# EAGLE design RaspiPowerHat (EAGLE 6.5.0)

## Sheet 1 of 3
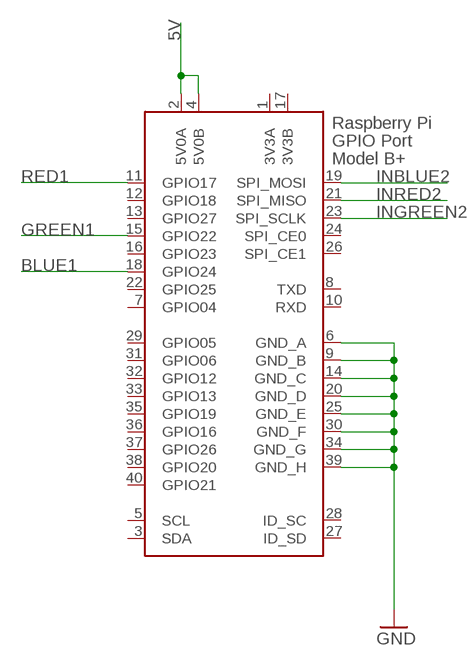
[diagram p0: schematic, sheet 1]

### Parts
X1  RASPI_GPIO_B+#_PIN  [RASPI_GPIO_B+_PIN]

### Nets
5V: X1.2(5V0A) X1.4(5V0B) ; also sheet 2
BLUE1: X1.18(GPIO24) ; also sheet 3
GND: X1.6(GND_A) X1.9(GND_B) X1.14(GND_C) X1.20(GND_D) X1.25(GND_E) X1.30(GND_F) X1.34(GND_G) X1.39(GND_H) ; also sheet 2,3
GREEN1: X1.15(GPIO22) ; also sheet 3
INBLUE2: X1.19(SPI_MOSI) ; also sheet 3
INGREEN2: X1.23(SPI_SCLK) ; also sheet 3
INRED2: X1.21(SPI_MISO) ; also sheet 3
RED1: X1.11(GPIO17) ; also sheet 3
Unconnected: X1.3(SDA) X1.5(SCL) X1.7(GPIO04) X1.8(TXD) X1.10(RXD) X1.12(GPIO18) X1.13(GPIO27) X1.16(GPIO23) X1.22(GPIO25) X1.24(SPI_CE0) X1.26(SPI_CE1) X1.27(ID_SD) X1.28(ID_SC) X1.29(GPIO05) X1.31(GPIO06) X1.32(GPIO12) X1.33(GPIO13) X1.35(GPIO19) X1.36(GPIO16) X1.37(GPIO26) X1.38(GPIO20) X1.40(GPIO21)

## Sheet 2 of 3: Power
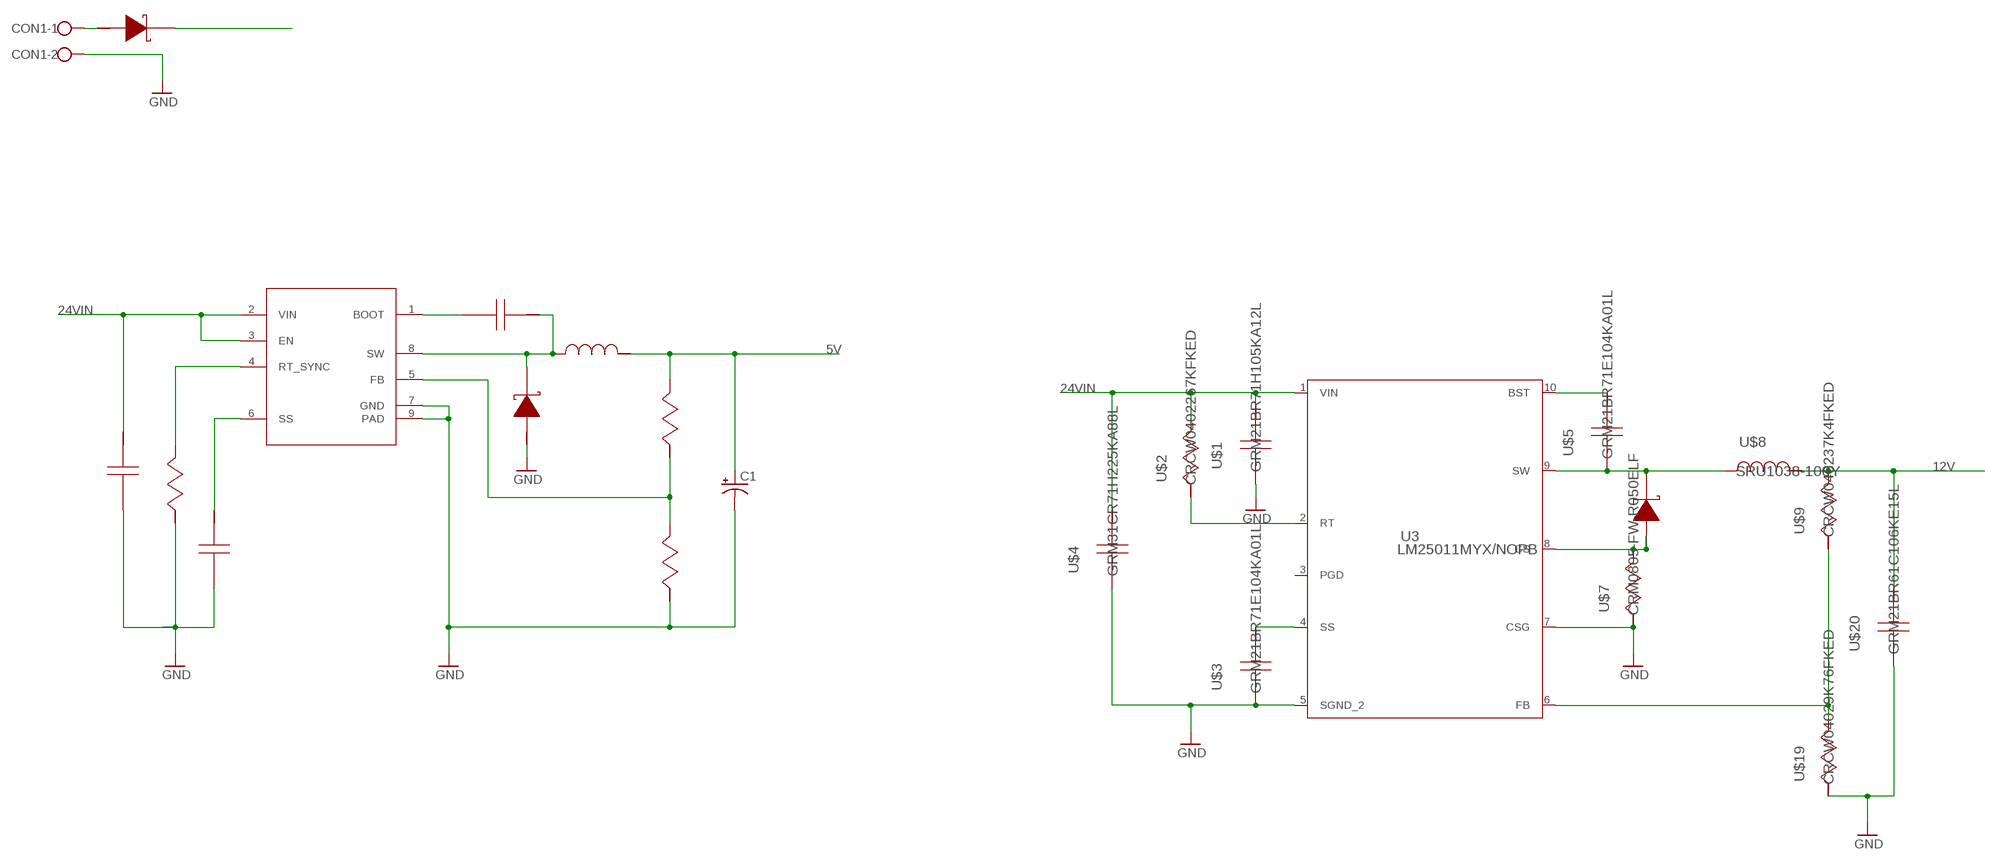
[diagram p1: schematic, sheet 2]

### Parts
C1  CPOL-USC  [PANASONIC_C]
CON1  W237-102  [W237-102]
U2  Value  LMR14050SDDAR  [DDA0008E_N]
U3  LM25011MYX/NOPB  [MUC10A]
U$1  GRM21BR71H105KA12L  [0805]
U$2  CRCW0402267KFKED  [0402]
U$3  GRM21BR71E104KA01L  [0805]
U$4  GRM31CR71H225KA88L  [1206_190]
U$5  GRM21BR71E104KA01L  [0805]
U$6  B360A-13-F  [SMA]
U$7  CRM0805-FW-R050ELF  [0805]
U$8  SRU1038-100Y  [SRU1038]
U$9  CRCW040237K4FKED  [0402]
U$10  C0805C104K5RACTU  [0805]
U$11  VLP8040T-6R8M  [VLP8040]
U$12  B360A-13-F  [SMA]
U$13  RC0603FR-0768KL  [0603]
U$14  RC0603FR-0712KL  [0603]
U$15  B360A-13-F  [SMA]
U$16  GRM155R71C822KA01D  [0402]
U$17  CRCW040224K3FKED  [0402]
U$18  GRM31CR71H225KA88L  [1206_190]
U$19  CRCW04029K76FKED  [0402]
U$20  GRM21BR61C106KE15L  [0805]

### Nets
5V: C1.+ U$11.2 U$13.1 ; also sheet 1
12V: U$8.2 U$9.1 U$20.1 ; also sheet 3
24VIN: U2.2(VIN) U2.3(EN) U3.1(VIN) U$1.1 U$2.1 U$4.1 U$15.1(K) U$18.1
GND: C1.- CON1.2 U2.7(GND) U2.9(PAD) U3.5(SGND_2) U3.7(CSG) U$1.2 U$3.2 U$4.2 U$7.2 U$12.2(A) U$14.2 U$16.2 U$17.2 U$18.2 U$19.2 U$20.2 ; also sheet 1,3
N$1: U3.2(RT) U$2.2
N$2: CON1.1 U$15.2(A)
N$3: U3.4(SS) U$3.1
N$4: U3.10(BST) U$5.1
N$5: U3.9(SW) U$5.2 U$6.1(K) U$8.1
N$6: U2.1(BOOT) U$10.2
N$7: U2.8(SW) U$10.1 U$11.1 U$12.1(K)
N$8: U2.5(FB) U$13.2 U$14.1
N$9: U2.6(SS) U$16.1
N$10: U2.4(RT_SYNC) U$17.1
N$11: U3.8(CS) U$6.2(A) U$7.1
N$14: U3.6(FB) U$9.2 U$19.1
Unconnected: U3.3(PGD)

## Sheet 3 of 3: LEDs
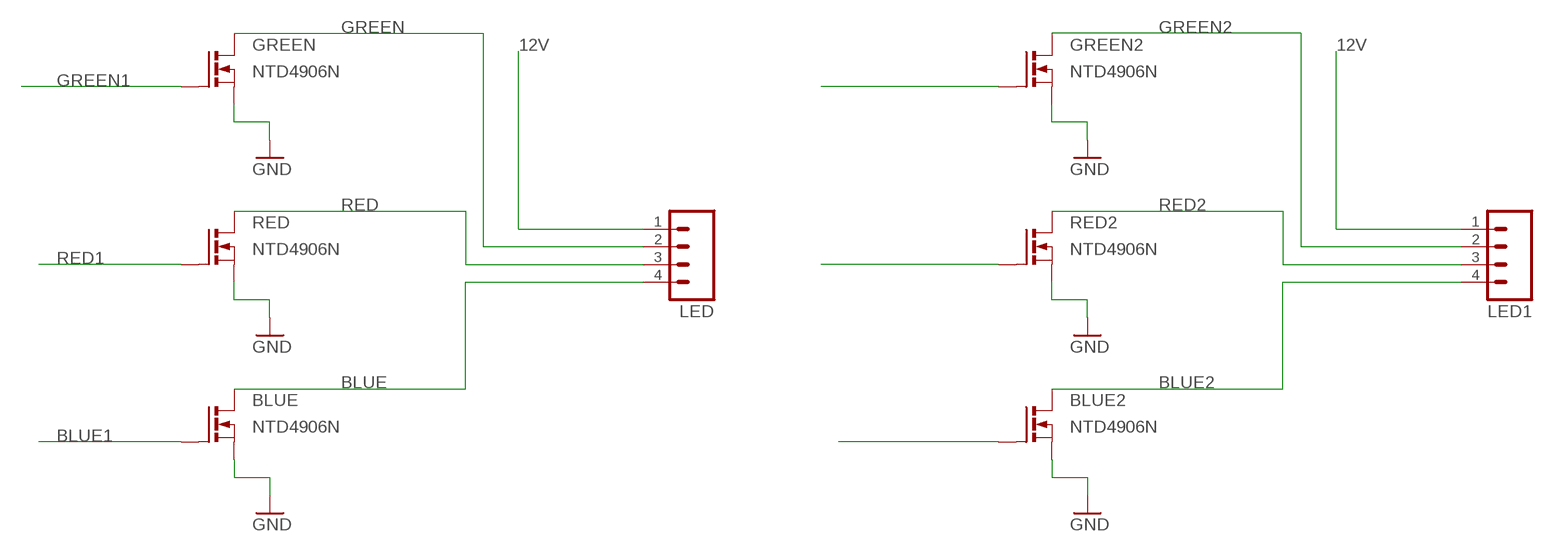
[diagram p2: schematic, sheet 3]

### Parts
BLUE  NTD4906N  4906N  [D-PAK_TO252AA]
BLUE2  NTD4906N  4906N  [D-PAK_TO252AA]
GREEN  NTD4906N  4906N  [D-PAK_TO252AA]
GREEN2  NTD4906N  4906N  [D-PAK_TO252AA]
LED  M04JST-PTH-VERT  [JST-4-PTH-VERT]
LED1  M04JST-PTH-VERT  [JST-4-PTH-VERT]
RED  NTD4906N  4906N  [D-PAK_TO252AA]
RED2  NTD4906N  4906N  [D-PAK_TO252AA]

### Nets
12V: LED1.1 LED.1 ; also sheet 2
BLUE: BLUE.4(D) LED.4
BLUE1: BLUE.1(G) ; also sheet 1
BLUE2: BLUE2.4(D) LED1.4
GND: BLUE2.3(SG1) BLUE.3(SG1) GREEN2.3(SG1) GREEN.3(SG1) RED2.3(SG1) RED.3(SG1) ; also sheet 1,2
GREEN: GREEN.4(D) LED.2
GREEN1: GREEN.1(G) ; also sheet 1
GREEN2: GREEN2.4(D) LED1.2
INBLUE2: BLUE2.1(G) ; also sheet 1
INGREEN2: GREEN2.1(G) ; also sheet 1
INRED2: RED2.1(G) ; also sheet 1
RED: LED.3 RED.4(D)
RED1: RED.1(G) ; also sheet 1
RED2: LED1.3 RED2.4(D)

## Power pins joined to a net without a drawn wire
3V3A: X1.1(3V3A)
3V3B: X1.17(3V3B)

## Library data of the parts
BLUE BLUE2 GREEN GREEN2 RED RED2 = transistor-power:4906N
C1 = rcl:CPOL-US: POLARIZED CAPACITOR, American symbol
CON1 = con-wago-500:W237-102: WAGO SCREW CLAMP; MPN: 237-102; OC_FARNELL: unknown; OC_NEWARK: 70K9898
LED LED1 = SparkFun-Connectors:M04: Header 4 Standard 4-pin 0.1" header. Use with straight break away headers (SKU : PRT-00116), right angle break away headers (PRT-00553), swiss pins (PRT-00743), machine pins (PRT-00117), and female headers (PRT-00115). Molex polarized connector foot print use with SKU : PRT-08231 with associated crimp pins and housings. 1MM SMD Version SKU: PRT-10208
U2 = TI-LMR14050SSDA:LMR14050SDDAR; ALTERNATEPARTNUMBER: LMR14050SDDA; APPLICATION_BUILDNUMBER: *; COMPTYPE: IC; MANUFACTURER: Texas Instruments; MANUFACTURER_NAME: Texas Instruments; MANUFACTURER_PART_NUMBER: LMR14050SDDAR; MOUNTTYPE: SMT; PACKAGEREFERENCE: DDA0008E; PARTNUMBER: LMR14050SDDAR; PIN_COUNT: 9; REFDES: RefDes; ROHS: Y; TYPE: TYPE
U3 = TILM25011:LM25011MYX/NOPB; DATASHEETURL: http://www.ti.com/product/lm25011; FREQUENCY: 2000000.0; IMAX: 2.0; MANUFACTURER_NAME: Texas Instruments; MANUFACTURER_PART_NUMBER: LM25011MYX/NOPB; MKTG_PACKAGE: NA; NSID: LM25011MY/NOPB; PACKAGE: NA; VENDOR: Texas Instruments
U$1 = TILM25011:GRM21BR71H105KA12L; CAP: 1.0E-6; ESR: 0.0; IRMS: 0.0; MANUFACTURER_NAME: MuRata; MANUFACTURER_PART_NUMBER: GRM21BR71H105KA12L; VDC: 50.0; VENDOR: MuRata
U$2 = TILM25011:CRCW0402267KFKED; MANUFACTURER_NAME: Vishay-Dale; MANUFACTURER_PART_NUMBER: CRCW0402267KFKED; POWER: 0.063; RESISTANCE: 267000.0; TOLERANCE: 1.0; VENDOR: Vishay-Dale
U$3 U$5 = TILM25011:GRM21BR71E104KA01L; CAP: 1.0E-7; ESR: 0.0; IRMS: 0.0; MANUFACTURER_NAME: MuRata; MANUFACTURER_PART_NUMBER: GRM21BR71E104KA01L; VDC: 25.0; VENDOR: MuRata
U$4 = TILM25011:GRM31CR71H225KA88L; CAP: 2.2E-6; ESR: 0.0; IRMS: 0.0; MANUFACTURER_NAME: MuRata; MANUFACTURER_PART_NUMBER: GRM31CR71H225KA88L; VDC: 50.0; VENDOR: MuRata
U$6 U$12 U$15 = TI-LMR14050SSDA:B360A-13-F; DATASHEETURL: http://www.diodes.com/datasheets/ds30891.pdf; IO: 3.0; MANUFACTURER_NAME: Diodes Inc.; MANUFACTURER_PART_NUMBER: B360A-13-F; VENDOR: Diodes Inc.; VFATIO: 0.7; VRRM: 60.0
U$7 = TILM25011:CRM0805-FW-R050ELF; MANUFACTURER_NAME: Bourns; MANUFACTURER_PART_NUMBER: CRM0805-FW-R050ELF; POWER: 0.25; RESISTANCE: 0.05; TOLERANCE: 1.0; VENDOR: Bourns
U$8 = TILM25011:SRU1038-100Y; DCR: 0.025; IDC: 3.8; L: 1.0E-5; MANUFACTURER_NAME: Bourns; MANUFACTURER_PART_NUMBER: SRU1038-100Y; VENDOR: Bourns
U$9 = TILM25011:CRCW040237K4FKED; MANUFACTURER_NAME: Vishay-Dale; MANUFACTURER_PART_NUMBER: CRCW040237K4FKED; POWER: 0.063; RESISTANCE: 37400.0; TOLERANCE: 1.0; VENDOR: Vishay-Dale
U$10 = TI-LMR14050SSDA:C0805C104K5RACTU; CAP: 1.0E-7; ESR: 0.064; IRMS: 1.64; MANUFACTURER_NAME: Kemet; MANUFACTURER_PART_NUMBER: C0805C104K5RACTU; VDC: 50.0; VENDOR: Kemet
U$11 = TI-LMR14050SSDA:VLP8040T-6R8M; DATASHEETURL: http://www.tdk.co.jp/tefe02/e531_vlp.pdf; DCR: 0.024; DESCRIPTION: Unknown; IDC: 3.6; L: 6.8E-6; MANUFACTURER: TDK; MANUFACTURER_NAME: TDK; MANUFACTURER_PART_NUMBER: VLP8040T-6R8M; PACKAGE_DESIGNATOR: VLP8040; VENDOR: TDK
U$13 = TI-LMR14050SSDA:RC0603FR-0768KL; MANUFACTURER_NAME: Yageo America; MANUFACTURER_PART_NUMBER: RC0603FR-0768KL; POWER: 0.1; RESISTANCE: 68000.0; TOLERANCE: 1.0; VENDOR: Yageo America
U$14 = TI-LMR14050SSDA:RC0603FR-0712KL; MANUFACTURER_NAME: Yageo America; MANUFACTURER_PART_NUMBER: RC0603FR-0712KL; POWER: 0.1; RESISTANCE: 12000.0; TOLERANCE: 1.0; VENDOR: Yageo America
U$16 = TI-LMR14050SSDA:GRM155R71C822KA01D; CAP: 8.2E-9; ESR: 0.0; IRMS: 0.0; MANUFACTURER_NAME: MuRata; MANUFACTURER_PART_NUMBER: GRM155R71C822KA01D; VDC: 16.0; VENDOR: MuRata
U$17 = TI-LMR14050SSDA:CRCW040224K3FKED; MANUFACTURER_NAME: Vishay-Dale; MANUFACTURER_PART_NUMBER: CRCW040224K3FKED; POWER: 0.063; RESISTANCE: 24300.0; TOLERANCE: 1.0; VENDOR: Vishay-Dale
U$18 = TI-LMR14050SSDA:GRM31CR71H225KA88L; CAP: 2.2E-6; ESR: 0.0; IRMS: 0.0; MANUFACTURER_NAME: MuRata; MANUFACTURER_PART_NUMBER: GRM31CR71H225KA88L; VDC: 50.0; VENDOR: MuRata
U$19 = TILM25011:CRCW04029K76FKED; MANUFACTURER_NAME: Vishay-Dale; MANUFACTURER_PART_NUMBER: CRCW04029K76FKED; POWER: 0.063; RESISTANCE: 9760.0; TOLERANCE: 1.0; VENDOR: Vishay-Dale
U$20 = TILM25011:GRM21BR61C106KE15L; CAP: 1.0E-5; ESR: 0.0080; IRMS: 0.0; MANUFACTURER_NAME: MuRata; MANUFACTURER_PART_NUMBER: GRM21BR61C106KE15L; VDC: 16.0; VENDOR: MuRata
X1 = raspberrypi_bastelstube_v13:RASPI_GPIO_B+#: 2x20 header connector, all pins connected

## Board
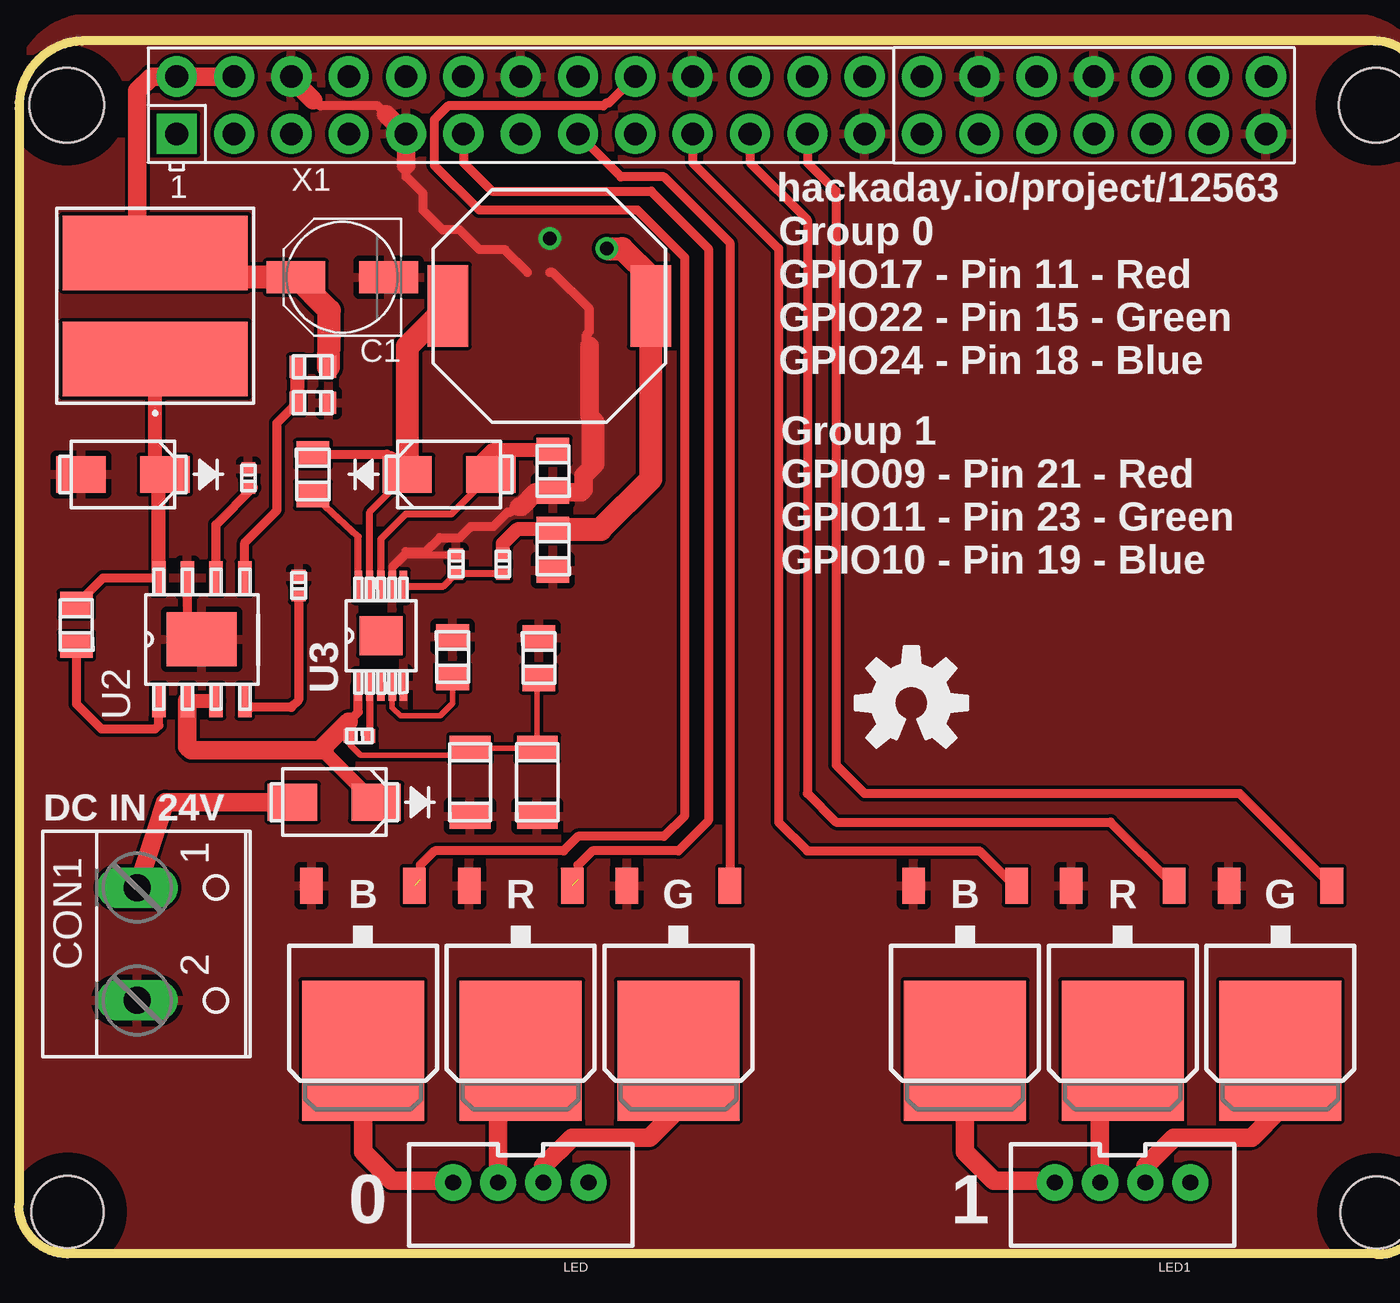
[diagram p3: board, top side]
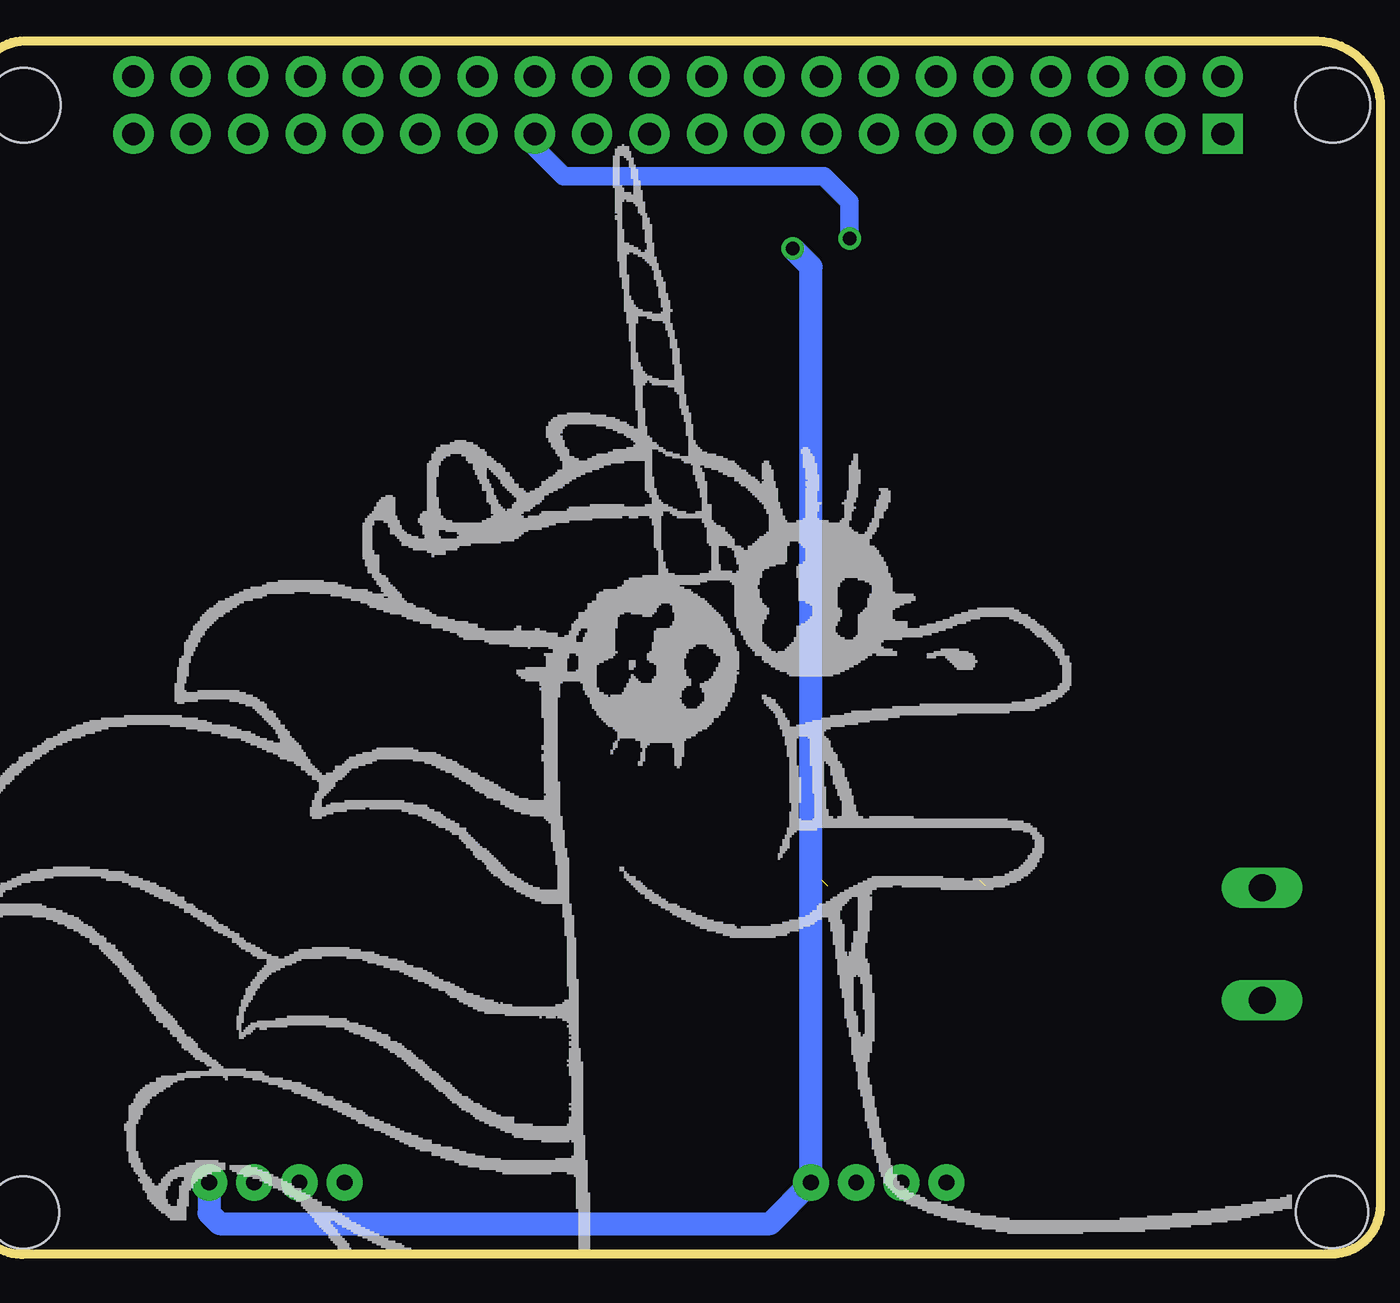
[diagram p4: board, bottom side, seen from below]

No outline drawn. Coordinates in mm, seen from the top.
Copper layers (1*16): Top 0.035mm / dielectric 1.5mm / Bottom 0.035mm
Design rules "default *": minimum track width 10mil, minimum drill 24mil, track to track 6mil, track to pad 6mil, pad to pad 6mil, via to via 6mil, smd to smd 6mil, copper to edge 40mil, drill to drill 8mil, minimum pad ring 10mil, minimum via ring 8mil, stop-mask expansion 4mil, vias tented up to drill 0mil, thermal gap 10mil
Holes 3.3 mm at 138.64,69.85 196.64,69.85
Holes 3.2 mm at 196.66,20.82 138.68,20.84
Milling: 10 lines

### Footprints (pad centres in the part's own frame; a part is rotated, then mirrored left to right if it is on the bottom)
D-PAK_TO252AA = smd 1 x 1.6: 1 -2.28,-4.8; 3 2.28,-4.8 | smd 5.4 x 6.2: 4 0,2.5
PANASONIC_C = smd 2.6 x 1.4: + 2.05,0; - -2.05,0
W237-102 = drill 1.194 long: 1 -2.5,-1.27; 2 2.5,-1.27
JST-4-PTH-VERT = drill 0.7 pad 1.6: 1 -3,-0.55; 2 -1,-0.55; 3 1,-0.55; 4 3,-0.55
DDA0008E_N = smd 1.45 x 0.6: 1 -2.725,1.905; 2 -2.725,0.635; 3 -2.725,-0.635; 4 -2.725,-1.905; 5 2.725,-1.905; 6 2.725,-0.635; 7 2.725,0.635; 8 2.725,1.905 | smd 2.4 x 3.1: 9 0,0
MUC10A = smd 1.372 x 0.33: 1 -2.197,1.001; 2 -2.197,0.5; 3 -2.197,0; 4 -2.197,-0.5; 5 -2.197,-1.001; 6 2.197,-1.001; 7 2.197,-0.5; 8 2.197,0; 9 2.197,0.5; 10 2.197,1.001 | smd 1.727 x 1.905: 11 0,0
0805 = smd 1.118 x 1.448: 1 -0.902,0; 2 0.902,0
0402 = smd 0.559 x 0.61: 1 -0.419,0; 2 0.419,0
1206_190 = smd 1.118 x 1.803: 1 -1.499,0; 2 1.499,0
SMA = smd 2.184 x 1.626: 1 -1.854,0; 2 1.854,0
SRU1038 = smd 1.803 x 3.607: 1 -4.496,0; 2 4.496,0
VLP8040 = smd 3.302 x 8.204: 1 -2.349,0; 2 2.349,0
0603 = smd 0.66 x 0.965: 1 -0.699,0; 2 0.699,0
RASPI_GPIO_B+_PIN = drill 1 pad 1.778 square: 1 -24.13,-1.27 | drill 1 pad 1.778: 2 -24.13,1.27; 3 -21.59,-1.27; 4 -21.59,1.27; 5 -19.05,-1.27; 6 -19.05,1.27; 7 -16.51,-1.27; 8 -16.51,1.27; 9 -13.97,-1.27; 10 -13.97,1.27; 11 -11.43,-1.27; 12 -11.43,1.27; 13 -8.89,-1.27; 14 -8.89,1.27; 15 -6.35,-1.27; 16 -6.35,1.27; 17 -3.81,-1.27; 18 -3.81,1.27; 19 -1.27,-1.27; 20 -1.27,1.27; 21 1.27,-1.27; 22 1.27,1.27; 23 3.81,-1.27; 24 3.81,1.27; 25 6.35,-1.27; 26 6.35,1.27; 27 8.89,-1.27; 28 8.89,1.27; 29 11.43,-1.27; 30 11.43,1.27; 31 13.97,-1.27; 32 13.97,1.27; 33 16.51,-1.27; 34 16.51,1.27; 35 19.05,-1.27; 36 19.05,1.27; 37 21.59,-1.27; 38 21.59,1.27; 39 24.13,-1.27; 40 24.13,1.27

### Placement (x,y rotation side)
BLUE  151.76,30.48 180 top
BLUE2  178.44,30.48 180 top
C1  150.84,62.23 180 top
CON1  143.03,32.7 270 top
GREEN  165.74,30.48 180 top
GREEN2  192.41,30.48 180 top
LED  158.75,21.59 180 top
LED1  185.42,21.59 180 top
RED  158.75,30.48 180 top
RED2  185.42,30.48 180 top
U2  144.62,46.2 90 top
U3  152.56,46.35 90 top
U$1  159.56,45.37 90 top
U$2  151.61,41.91 0 top
U$3  155.73,45.4 90 top
U$4  159.48,39.87 270 top
U$5  149.54,53.5 90 top
U$6  155.57,53.5 0 top
U$7  160.18,53.66 270 top
U$8  160.02,60.96 0 top
U$9  157.96,49.53 270 top
U$10  139.06,46.83 270 top
U$11  142.56,60.96 90 top
U$12  141.13,53.5 180 top
U$13  149.54,58.26 180 top
U$14  149.54,56.67 0 top
U$15  150.5,38.98 180 top
U$16  146.69,53.34 90 top
U$17  148.91,48.58 90 top
U$18  156.51,39.87 270 top
U$19  155.89,49.53 90 top
U$20  160.18,50.16 270 top
U$21  [OSHW-LOGO-M]  176.06,43.37 0 top
X1  167.64,69.85 0 top

### Tracks (layer width: path | path; a pad name or v marks a point on that pad's centre or on a via)
5V
  Top 0.61: 144.78,62.23 143.51,63.5 142.75,63.5 U$11.2
  Top 0.813: X1.4 X1.2 142.4,71.12 141.76,70.48 141.76,63.34 142.53,63.34 U$11.2
  Top 1.016: 144.78,62.23 C1.+ 150.27,60.76 150.27,59.6 U$13.1
12V  (via drill 0.6)
  Top 0.61: U$20.1 158.59,51.07 157.96,50.43 U$9.1
  Top 1.016: U$20.1 162.29,51.07 164.52,53.29 U$8.2 164.52,62.23 163.25,63.5 v162.56,63.5
  Bottom 1.016: LED1.1 188.42,20.78 187.96,20.32 163.57,20.32 LED.1 161.75,62.69 v162.56,63.5
24VIN
  Top 0.254: U$1.1 159.37,44.28 159.48,44.16 U$4.1 U$18.1 155.56,41.05 151.67,41.05 151.19,41.53 U$2.1
  Top 0.406: U$15.1 152.28,38.98 | 151.13,42.55 151.56,42.97 U3.1
  Top 0.61: U2.2 U2.3 | 152.28,38.98 150.18,41.08 150.18,41.59 | U$2.1 150.87,42.23 150.81,42.23
  Top 0.813: U2.2 143.99,41.43 144.15,41.27 149.86,41.27 150.18,41.59 150.81,42.23 151.13,42.55
BLUE
  Top 0.813: LED.4 155.75,22.23 153.03,22.23 151.76,23.5 BLUE.4
BLUE1  (1 unrouted)
  Top 0.406: X1.18 162.66,69.95 162.54,69.95 162.42,69.83 155.54,69.83 154.92,69.2 154.92,67.2 156.92,65.2 163.92,65.2 166.02,63.1 166.02,38.38 165.1,37.47 161.29,37.47 160.66,36.83 154.94,36.83 154.31,36.2 154.31,35.54
BLUE2
  Top 0.406: 178.44,26.12 BLUE2.4
  Top 0.813: LED1.4 182.34,22.23 179.71,22.23 178.44,23.5 BLUE2.4
GND  (via drill 0.6)
  Top 0.305: U$19.2 153.69,49.95 153.06,49.31 U3.7 153.06,49.46 153.67,50.08
  Top 0.406: U2.7 143.99,46.83 U2.9 | 153.67,50.08 154.54,50.08 155.17,50.7 156.04,50.7 156.54,51.2 157.54,51.2 158.17,51.83 158.29,51.83 158.54,52.08 158.67,52.08 159.17,52.58 161.42,52.58 161.67,52.83 161.67,59.7 161.79,59.83 161.79,60.83 160.17,62.45 160.04,62.45 | 159.04,62.45 158.04,63.45 156.92,63.45 156.04,64.33 155.29,64.33 154.42,65.2 154.42,65.95 153.67,66.7 153.67,67.2 | 152.79,69.45 152.42,69.83 149.88,69.83 X1.6
  Top 0.813: 152.79,69.45 X1.9 153.67,67.2 | 158.67,52.08 158.79,52.08 159.42,52.7 161.42,52.7 161.54,52.83 161.54,53.45 162.04,53.95 162.04,55.83 161.79,56.08 161.79,59.2
  Bottom 0.813: v160.04,63.95 160.04,65.58 161.17,66.7 172.72,66.7 173.99,67.97 X1.25
  pour Top: 196.22,73.66 139.06,73.66 arc90 136.53,69.85 136.53,21.59 arc90 139.06,19.05 196.85,19.05 arc90 198.75,20.95 198.75,69.85 arc90
GREEN
  Top 0.813: LED.2 159.75,22.86 161.02,24.13 164.47,24.13 165.74,25.4 GREEN.4
GREEN1
  Top 0.406: X1.15 163.19,66.67 165.1,66.67 168.01,63.76 GREEN.1
GREEN2
  Top 0.813: LED1.2 186.42,22.86 187.69,24.13 191.13,24.13 192.41,25.4 GREEN2.4
  Top 1.27: GREEN2.4 192.41,28.57 191.77,29.21 191.77,28.61 GREEN2.4
INBLUE2
  Top 0.406: X1.19 166.37,67.31 170.18,63.5 170.18,38.1 171.45,36.83 179.07,36.83 180.62,35.28 BLUE2.1
INGREEN2
  Top 0.406: X1.23 171.45,67.31 172.72,66.04 172.72,40.64 173.99,39.37 190.59,39.37 GREEN2.1
INRED2
  Top 0.406: X1.21 168.91,67.31 171.45,64.77 171.45,39.37 172.72,38.1 184.88,38.1 RED2.1
N$1
  Top 0.305: U3.2 152.06,41.94 arc-90 U$2.2
N$2
  Top 0.813: CON1.1 143,38.98 U$15.2
N$3
  Top 0.254: U3.4 153.06,43.16 153.42,42.8 155.17,42.8 155.73,43.36 U$3.1
N$4
  Top 0.305: U3.10 151.56,50.74 U$5.1
N$5
  Top 0.305: U3.9 152.06,51.84 U$6.1
  Top 0.406: U$5.2 152.82,54.4 U$6.1
  Top 0.61: 152.98,54.23 U$6.1
  Top 1.016: U$8.1 153.72,59.16 U$6.1
N$6
  Top 0.406: U$10.2 139.06,43.34 140.18,42.23 142.56,42.23 142.72,42.39 U2.1
N$7
  Top 0.406: U$10.1 140.25,48.92 U2.8
  Top 0.61: U2.8 142.72,53.23 U$12.1 142.56,53.92 U$11.1
N$8
  Top 0.406: U2.5 146.53,50.48 147.96,51.91 147.96,55.78 U$14.1
  Top 0.61: U$13.2 U$14.1
N$9
  Top 0.406: U2.6 145.26,51.28 146.9,52.92 U$16.1
N$10
  Top 0.406: U$17.1 148.91,43.5 148.59,43.18 146.82,43.18 U2.4
N$11
  Top 0.305: U3.8 152.56,50.64 153.67,51.75 155.68,51.75 U$6.2
  Top 0.61: U$7.1 157.48,54.56 156.84,53.92 156.84,53.66 157.27,53.66 U$6.2
N$12
  Top 0.813: 149.54,70.08 148.54,71.08 148.54,70.81
N$14
  Top 0.305: U3.6 155.33,48.55 U$19.1 U$9.2
RED
  Top 0.813: LED.3 157.75,27.94 158.12,27.94 158.12,27.98 RED.4
  Top 1.016: 159.02,26.98 RED.4
RED1  (1 unrouted)
  Top 0.406: X1.11 156.21,67.31 157.48,66.04 164.53,66.04 167.07,63.5 167.07,38.16 165.74,36.83 161.93,36.83 161.29,36.2 161.29,35.54
RED2
  Top 0.406: 184.42,27.98 184.78,27.98 RED2.4
  Top 0.813: LED1.3 184.42,27.61 184.78,27.98

### Text on the board
tPlace: hackaday.io/project/12563 | Group 0 / GPIO17 - Pin 11 - Red / GPIO22 - Pin 15 - Green / GPIO24 - Pin 18 - Blue | Group 1 / GPIO09 - Pin 21 - Red / GPIO11 - Pin 23 - Green / GPIO10 - Pin 19 - Blue | DC IN 24V | B | R | G | B | R | G | 0 | 1
bPlace: C:/Users/bench_000/Desktop/Unicorn.bmp